# EAGLE design USBFeederPCB (EAGLE 9.5.2)
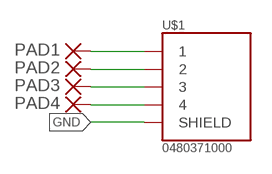
[diagram p0: schematic, sheet 1]

## Parts
PAD1  SMD2  [SMD1,27-2,54]
PAD2  SMD2  [SMD1,27-2,54]
PAD3  SMD2  [SMD1,27-2,54]
PAD4  SMD2  [SMD1,27-2,54]
U$1  0480371000  [0480371000]

## Nets
GND: U$1.SHIELD1(SHIELD) U$1.SHIELD2(SHIELD)
N$1: PAD1.1(P) U$1.1
N$2: PAD2.1(P) U$1.2
N$3: PAD3.1(P) U$1.3
N$4: PAD4.1(P) U$1.4

## Library data of the parts
PAD1-PAD4 = wirepad:SMD2: SMD PAD
U$1 = PNPFeeder:0480371000

## Board
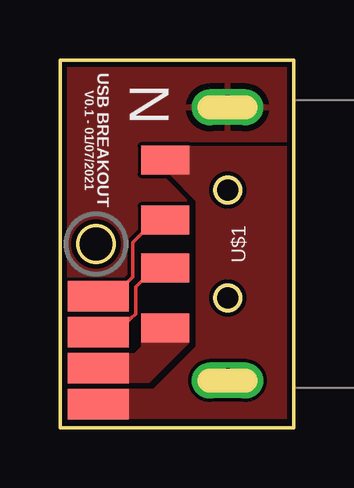
[diagram p1: board, top side]
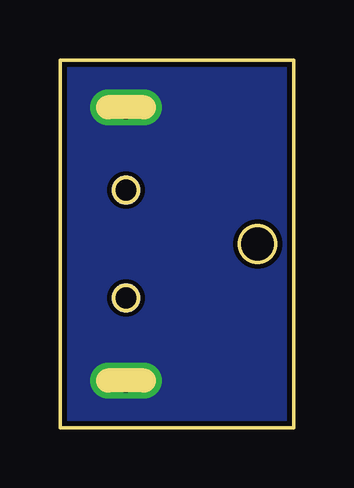
[diagram p2: board, bottom side, seen from below]

Size 9.73 x 15.35 mm. Coordinates in mm from the lower left corner, seen from the top.
Outline: 0,15.35 0,0 9.73,0 9.73,15.35 0,15.35
Outline: circle at 6.99,5.42 radius 0.5
Outline: circle at 6.99,9.93 radius 0.5
Outline: circle at 1.5,7.67 radius 0.75
Copper layers (1*16): Top 0.035mm / dielectric 1.5mm / Bottom 0.035mm
Design rules "aisler_2_layer": minimum track width 0.1mm, minimum drill 0.2mm, track to track 0.15mm, track to pad 0.15mm, pad to pad 0.1mm, via to via 0.1mm, smd to smd 0.1mm, copper to edge 0.2mm, drill to drill 0.21mm, minimum pad ring 0.25mm, minimum via ring 0.15mm, stop-mask expansion 0mil, vias tented up to drill 0mil, thermal gap 10mil

### Footprints (pad centres in the part's own frame; a part is rotated, then mirrored left to right if it is on the bottom)
SMD1,27-2,54 = smd 1.27 x 2.54: 1 0,0
0480371000 = smd 1.2 x 2: 1 3.5,2.6; 2 1,2.6; 3 -1,2.6; 4 -3.5,2.6 | drill 1 long: SHIELD1 -5.7,0; SHIELD2 5.7,0 | hole 1.1: -2.25,0; 2.25,0

### Placement (x,y rotation side)
PAD1  1.6,1 90 top
PAD2  1.6,5.5 90 top
PAD3  1.6,4 90 top
PAD4  1.6,2.5 90 top
U$1  6.99,7.68 90 top
U$2  [LOGO]  3.7,13.5 270 top

### Tracks (layer width: path | path; a pad name or v marks a point on that pad's centre or on a via)
GND
  pour Bottom (no thermals): -1,16.5 11,16.5 11,-1 -1,-1
  pour Top (rank 6): -2,17 12,17 12,-2 -2,-2
N$1
  pour Top (no thermals): 3.5,10.65 4.57,10.65 5.73,9.49 5.73,3.39 3.9,1.56 2.5,1.56 2.5,0.44 10.5,0.44 10.5,11 9.8,11.7 3.5,11.7
N$2
  Top 0.15: 3.99,8.68 3.04,7.73 3.04,6.3 2.24,5.5 PAD2.1
  Top 0.2: U$1.2 3.99,8.68 | 2.42,5.5 PAD2.1 2.21,5.5
N$3
  Top 0.15: 2.19,4.56 2.95,4.56 | 2.95,4.56 3.15,4.76 3.15,5.87 3.96,6.68 | 2.39,4 2.95,4.56
  Top 0.2: 3.96,6.68 U$1.3 4.28,6.68 | PAD3.1 2.39,4
N$4
  pour Top (no thermals): 2,3.03 3.15,3.03 3.49,3.37 3.49,4.5 5.28,4.5 5.28,3.58 3.66,1.96 2,1.96

### Text on the board
tPlace: V0.1 - 01/07/2021 | USB BREAKOUT